# EAGLE schematic Schematic_Eagle (EAGLE 7.7.0)
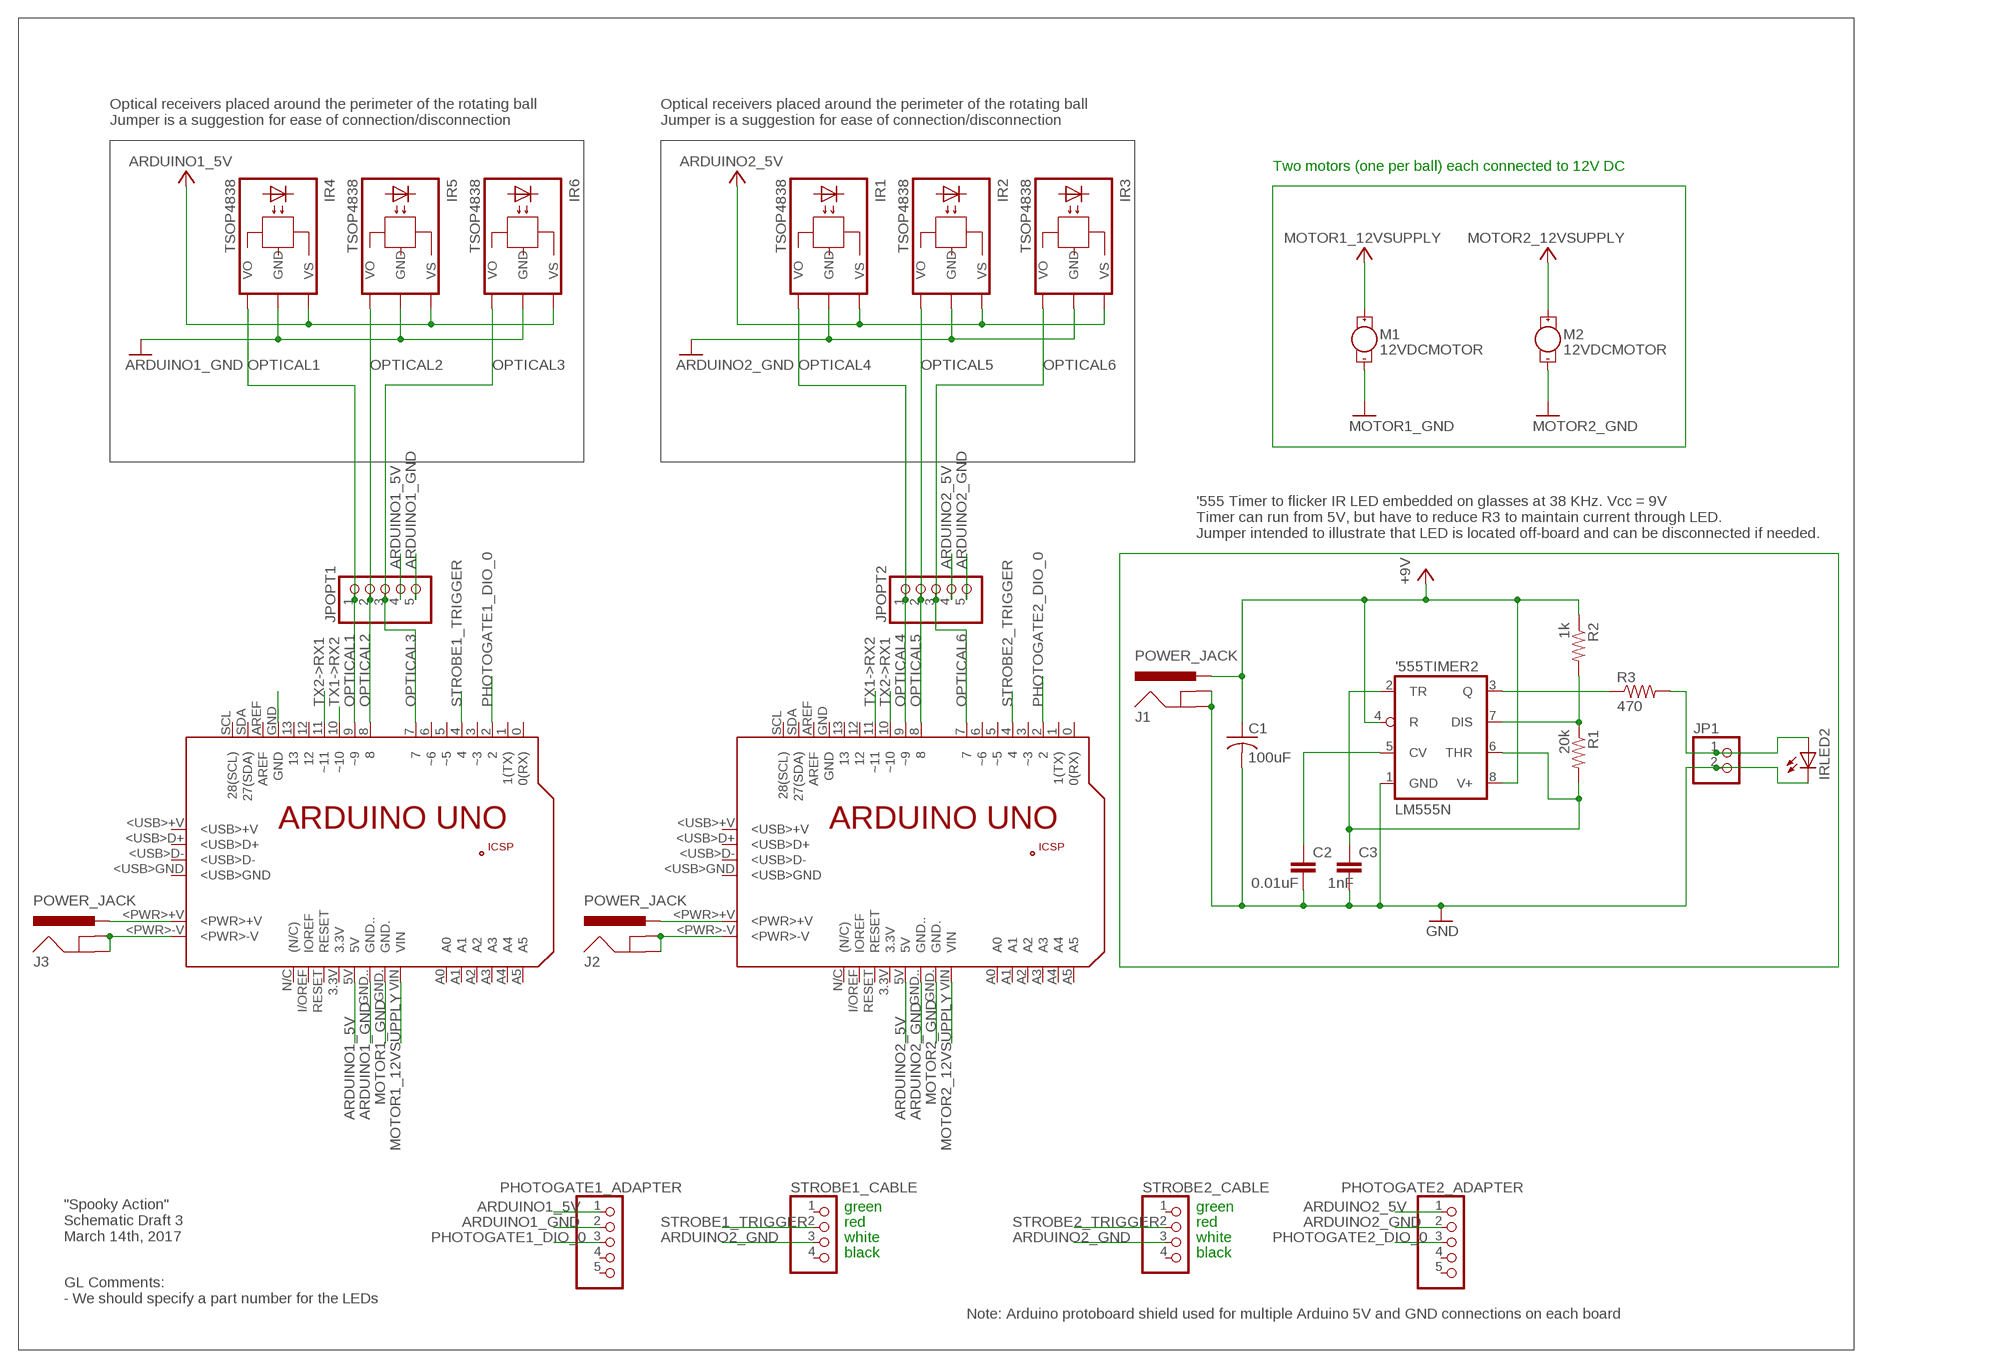
[diagram p0: schematic, sheet 1]

## Parts
'555TIMER2  LM555N  [DIL08]
C1  100uF  C-USC0402  [C0402]
C2  0.01uF  C2,5-3  [C2.5-3]
C3  1nF  C2,5-3  [C2.5-3]
IR1  TSOP4838  TSOP1738TB1  [TSOP17_TB1]
IR2  TSOP4838  TSOP1738TB1  [TSOP17_TB1]
IR3  TSOP4838  TSOP1738TB1  [TSOP17_TB1]
IR4  TSOP4838  TSOP1738TB1  [TSOP17_TB1]
IR5  TSOP4838  TSOP1738TB1  [TSOP17_TB1]
IR6  TSOP4838  TSOP1738TB1  [TSOP17_TB1]
IRLED2  SFH482  [SFH482]
J1  POWER_JACK  [POWER_JACK_PTH]
J2  POWER_JACK  [POWER_JACK_PTH]
J3  POWER_JACK  [POWER_JACK_PTH]
JP1  PINHD-1X2  [1X02]
JPOPT1  PINHD-1X5  [1X05]
JPOPT2  PINHD-1X5  [1X05]
M1  12VDCMOTOR  MOTOR10MM  [VIBE-MOTOR-10MM]
M2  12VDCMOTOR  MOTOR10MM  [VIBE-MOTOR-10MM]
PCB1  ARDUINO_UNO  [ARDUINO_UNO]
PCB2  ARDUINO_UNO  [ARDUINO_UNO]
PHOTOGATE1_ADAPTER  PINHD-1X5  [1X05]
PHOTOGATE2_ADAPTER  PINHD-1X5  [1X05]
R1  20k  RES-US1206FAB  [R1206FAB]
R2  1k  RES-US1206FAB  [R1206FAB]
R3  470  RES-US1206FAB  [R1206FAB]
STROBE1_CABLE  PINHD-1X4  [1X04]
STROBE2_CABLE  PINHD-1X4  [1X04]

## Nets
12VJACK2: J2.PWR PCB2.<PWR>+V
12VJACK2(GND): J2.GND J2.GNDBREAK PCB2.<PWR>-V
12VMOTOR1_SUPPLY: M1.+ ; supply symbol labelled MOTOR1_12VSUPPLY
ARDUINO1_5V: IR4.VS IR5.VS IR6.VS JPOPT1.4 PCB1.5V PHOTOGATE1_ADAPTER.1
ARDUINO1_GND: IR4.VO(GND) IR5.VO(GND) IR6.VO(GND) JPOPT1.5 PCB1.GND.. PHOTOGATE1_ADAPTER.2
ARDUINO2_5V: IR1.VS IR2.VS IR3.VS JPOPT2.4 PCB2.5V PHOTOGATE2_ADAPTER.1
ARDUINO2_GND: IR1.VO(GND) IR2.VO(GND) IR3.VO(GND) JPOPT2.5 PCB2.GND.. PHOTOGATE2_ADAPTER.2 STROBE1_CABLE.3 STROBE2_CABLE.3
GND: '555TIMER2.1(GND) C1.2 C2.2 C3.2 IRLED2.K(C) J1.GND J1.GNDBREAK JP1.2 M1.- M2.- ; supply symbol labelled MOTOR1_GND, MOTOR2_GND
MOTOR1_12VSUPPLY: PCB1.VIN
MOTOR1_GND: PCB1.GND.
MOTOR2_12VSUPPLY: M2.+ PCB2.VIN
MOTOR2_GND: PCB2.GND.
N$1: '555TIMER2.3(Q) R3.1
N$2: '555TIMER2.7(DIS) R1.1 R2.2
N$3: '555TIMER2.2(TR) '555TIMER2.6(THR) C3.1 R1.2
N$4: '555TIMER2.5(CV) C2.1
N$5: IRLED2.A JP1.1 R3.2
N$8: J3.PWR PCB1.<PWR>+V
N$9: J3.GND J3.GNDBREAK PCB1.<PWR>-V
N$10: PCB1.GND
OPTICAL1: IR4.GND(VO) JPOPT1.1 PCB1.9(~9)
OPTICAL2: IR5.GND(VO) JPOPT1.2 PCB1.8
OPTICAL3: IR6.GND(VO) JPOPT1.3 PCB1.7
OPTICAL4: IR1.GND(VO) JPOPT2.1 PCB2.9(~9)
OPTICAL5: IR2.GND(VO) JPOPT2.2 PCB2.8
OPTICAL6: IR3.GND(VO) JPOPT2.3 PCB2.7
PHOTOGATE1_DIO_0: PCB1.2 PHOTOGATE1_ADAPTER.3
PHOTOGATE2_DIO_0: PCB2.2 PHOTOGATE2_ADAPTER.3
STROBE1_TRIGGER: PCB1.4 STROBE1_CABLE.2
STROBE2_TRIGGER: PCB2.4 STROBE2_CABLE.2
TX1->RX2: PCB1.10(~10) PCB2.11(~11)
TX2->RX1: PCB1.11(~11) PCB2.10(~10)
VCC: '555TIMER2.4(R) '555TIMER2.8(V+) C1.1 J1.PWR R2.1 ; supply symbol labelled +9V
Unconnected: PCB1.0(0(RX)) PCB1.1(1(TX)) PCB1.3(~3) PCB1.3.3V PCB1.5(~5) PCB1.6(~6) PCB1.12 PCB1.13 PCB1.+5V PCB1.<USB>+V PCB1.<USB>D+ PCB1.<USB>D- PCB1.<USB>GND PCB1.A0 PCB1.A1 PCB1.A2 PCB1.A3 PCB1.A4 PCB1.A5 PCB1.AREF PCB1.GND_ PCB1.I/OREF(IOREF) PCB1.MISO PCB1.MOSI PCB1.N/C((N/C)) PCB1.RESET PCB1.RESET. PCB1.SCK PCB1.SCL(28(SCL)) PCB1.SDA(27(SDA)) PCB2.0(0(RX)) PCB2.1(1(TX)) PCB2.3(~3) PCB2.3.3V PCB2.5(~5) PCB2.6(~6) PCB2.12 PCB2.13 PCB2.+5V PCB2.<USB>+V PCB2.<USB>D+ PCB2.<USB>D- PCB2.<USB>GND PCB2.A0 PCB2.A1 PCB2.A2 PCB2.A3 PCB2.A4 PCB2.A5 PCB2.AREF PCB2.GND PCB2.GND_ PCB2.I/OREF(IOREF) PCB2.MISO PCB2.MOSI PCB2.N/C((N/C)) PCB2.RESET PCB2.RESET. PCB2.SCK PCB2.SCL(28(SCL)) PCB2.SDA(27(SDA)) PHOTOGATE1_ADAPTER.4 PHOTOGATE1_ADAPTER.5 PHOTOGATE2_ADAPTER.4 PHOTOGATE2_ADAPTER.5 STROBE1_CABLE.1 STROBE1_CABLE.4 STROBE2_CABLE.1 STROBE2_CABLE.4

## Notes on the sheet
- Optical receivers placed around the perimeter of the rotating ball
  Jumper is a suggestion for ease of connection/disconnection
- Optical receivers placed around the perimeter of the rotating ball
  Jumper is a suggestion for ease of connection/disconnection
- Two motors (one per ball) each connected to 12V DC
- '555 Timer to flicker IR LED embedded on glasses at 38 KHz. Vcc = 9V
  Timer can run from 5V, but have to reduce R3 to maintain current through LED.
  Jumper intended to illustrate that LED is located off-board and can be disconnected if needed.
- green | green
- red | red
- white | white
- "Spooky Action"
  Schematic Draft 3
  March 14th, 2017
- black | black
- GL Comments:
  - We should specify a part number for the LEDs
- Note: Arduino protoboard shield used for multiple Arduino 5V and GND connections on each board

## Library data of the parts
'555TIMER2 = linear:*555: TIMER
C1 = resistor:C-US: CAPACITOR, American symbol
C2 C3 = capacitor-wima:C: CAPACITOR naming: grid - package width
IR1-IR6 = spooky:TSOP17*TB1: TSOP17..TB1 IR Receiver Modules for Remote Control Systems Source: http://www.vishay.com/docs/82042/82042.pdf; OC_FARNELL: unknown; OC_NEWARK: unknown
IRLED2 = led:SFH482: IR LED infrared emitting diode, Infineon
J1-J3 = SparkFun-Connectors:POWER_JACK: Power Jack Connector This is the standard 5.5mm barrel jack for power. The PTH is the most common, proven, reliable, footprint. The Slot footprint only works if the mill layer is transmitted to the PCB fab house so be warned. Here are the connectors we sell at SparkFun: DC Barrel Power Jack/Connector <https://www.sparkfun.com/products/119> (PRT-00119) DC Barrel Power Jack/Connector (SMD) <https://www.sparkfun.com/products/12748> (PRT-12748) DC Barrel Jack Adapter - Breadboard Compatible <https://www.sparkfun.com/products/10811> (PRT-10811) It is used on this SparkFun product (and many, many others): SparkFun RedBoard - Programmed with Arduino <https://www.sparkfun.com/products/12757> (DEV-12757) Also, if you need a mating power supply or connector, please check these out: Wall Adapter Power Supply - 9VDC 650mA <https://www.sparkfun.com/products/298> (TOL-00298) DC Barrel Jack Adapter - Male <https://www.sparkfun.com/products/10287> (PRT-10287); PROD_ID: CONN-08197
JP1 = pinhead:PINHD-1X2: PIN HEADER
JPOPT1 JPOPT2 PHOTOGATE1_ADAPTER PHOTOGATE2_ADAPTER = pinhead:PINHD-1X5: PIN HEADER
M1 M2 = SparkFun-Electromechanical:MOTOR: Motor (Single-Phase) Two-terminal, single-phase motors. SparkFun Products Vibration Motor <https://www.sparkfun.com/products/8449> (ROB-08449) Physical dimension and wire connections for this powerful vibration motor. Motor has a self adhesive backing.; PROD_ID: COMP-08572; SF_SKU: ROB-08449
PCB1 PCB2 = E14_Arduino_revC:ARDUINO_UNO: Device for representing an Arduino Uno board with a footprint in an EAGLE design. Created by Dave Young for Element14. More EAGLE documentation at: http://www.element14.com/community/community/knode/cadsoft_eagle
R1-R3 = fab_copy:RES-US: Resistor (US Symbol) Variants with postfix FAB are widened to allow the routing of internal traces
STROBE1_CABLE STROBE2_CABLE = pinhead:PINHD-1X4: PIN HEADER